# EAGLE design 405_led_jetracer (EAGLE 9.6.2)
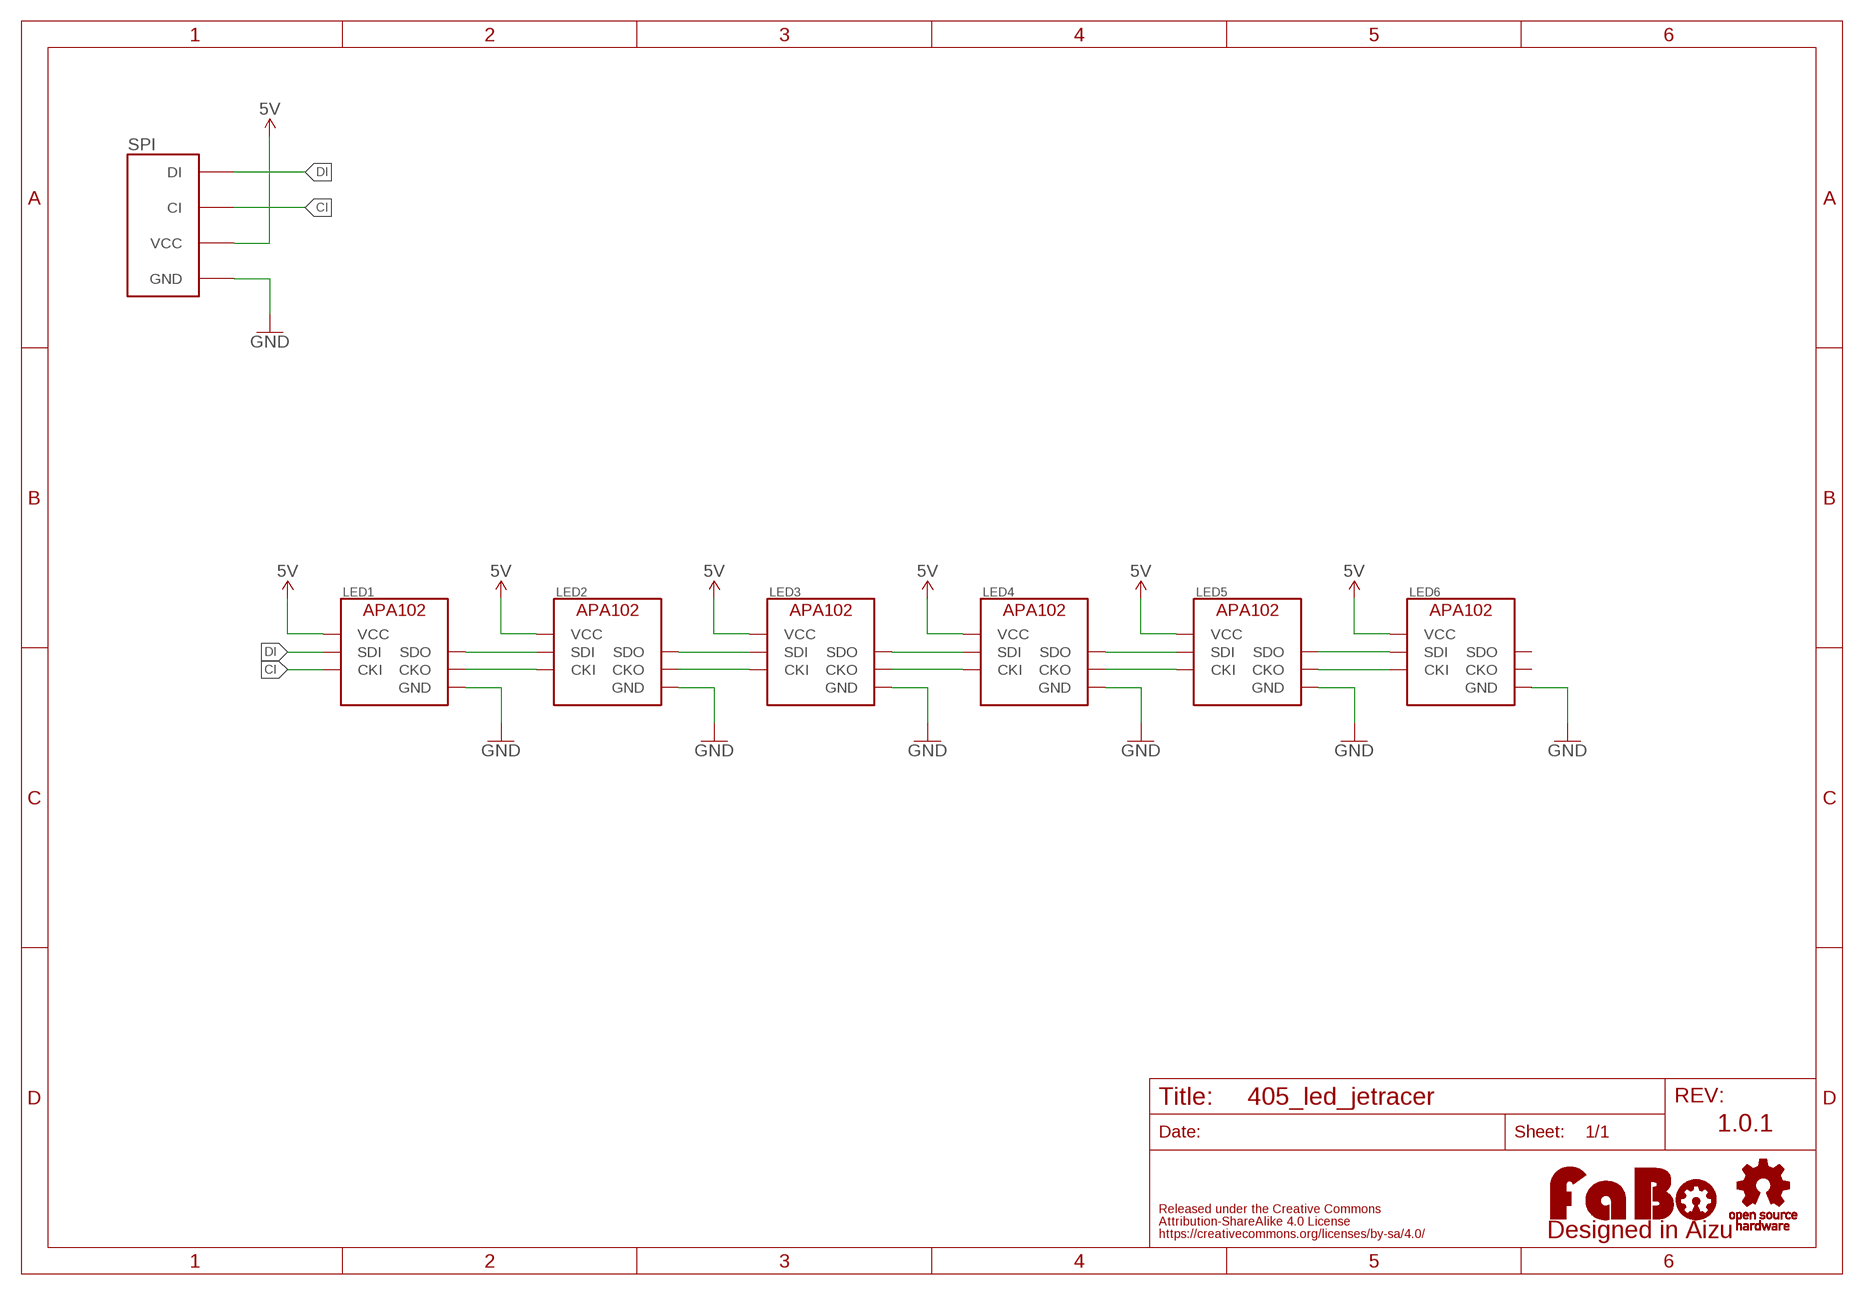
[diagram p0: schematic, sheet 1]

## Parts
LED1  APA102_IPIXEL  [APA102_2020]
LED2  APA102_IPIXEL  [APA102_2020]
LED3  APA102_IPIXEL  [APA102_2020]
LED4  APA102_IPIXEL  [APA102_2020]
LED5  APA102_IPIXEL  [APA102_2020]
LED6  APA102_IPIXEL  [APA102_2020]
LOGO1  LOGO_OSHW-S_BOTTOM  [LOGO_OSHW_S_BOTTOM]
LOGO2  LOGO_FABO-S  [LOGO_FABO_S]
SPI  FABO-SPI-LED-B04B  [SPI-B04B-PASK-1]

## Nets
5V: LED1.VCC LED2.VCC LED3.VCC LED4.VCC LED5.VCC LED6.VCC SPI.VCC
CI: LED1.CKI SPI.CI
CI1: LED1.CKO LED2.CKI
CI2: LED2.CKO LED3.CKI
CI3: LED3.CKO LED4.CKI
CI4: LED4.CKO LED5.CKI
CI5: LED5.CKO LED6.CKI
DI: LED1.SDI SPI.DI
DI1: LED1.SDO LED2.SDI
DI2: LED2.SDO LED3.SDI
DI3: LED3.SDO LED4.SDI
DI4: LED4.SDO LED5.SDI
DI5: LED5.SDO LED6.SDI
GND: LED1.GND LED2.GND LED3.GND LED4.GND LED5.GND LED6.GND SPI.GND
Unconnected: LED6.CKO LED6.SDO

## Notes on the sheet
- 1.0.1

## Library data of the parts
LED1-LED6 = FaBo-LED:APA102
LOGO1 = FaBo-Logo:LOGO_OSHW
LOGO2 = FaBo-Logo:LOGO_FABO
SPI = FaBo-Connetor:FABO-SPI-LED

## Board
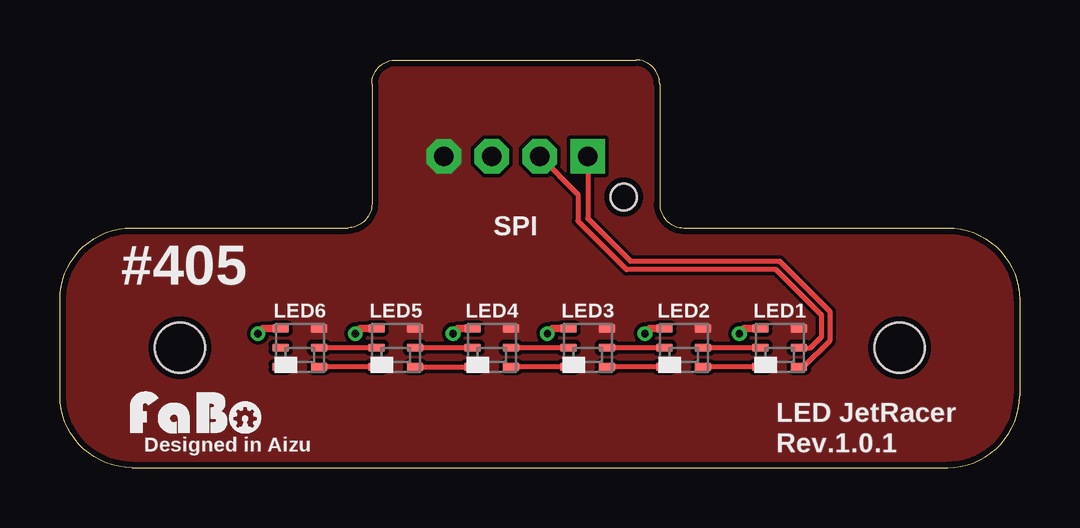
[diagram p1: board, top side]
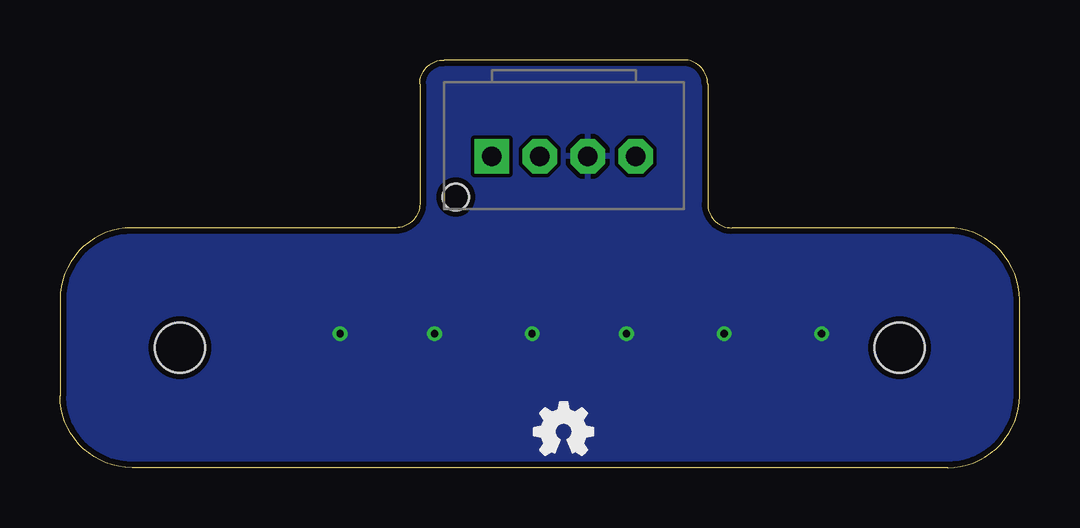
[diagram p2: board, bottom side, seen from below]

Size 40 x 17 mm. Coordinates in mm from the lower left corner, seen from the top.
Outline: 3,0 37,0 arc90 40,3 40,7 arc90 37,10 26,10 arc-90 25,11 25,16 arc90 24,17 14,17 arc90 13,16 13,11 arc-90 12,10 3,10 arc90 0,7 0,3 arc90 3,0
Copper layers (1*16): Top 0.035mm / dielectric 1.6mm / Bottom 0.035mm
Design rules "PCBway": minimum track width 6mil, minimum drill 12mil, track to track 6mil, track to pad 6mil, pad to pad 6mil, via to via 6mil, smd to smd 6mil, copper to edge 10mil, drill to drill 10mil, minimum pad ring 10mil, minimum via ring 6mil, stop-mask expansion 2mil, vias tented up to drill 100mil, thermal gap 8mil
Holes 2.1 mm at 5,5 35,5

### Footprints (pad centres in the part's own frame; a part is rotated, then mirrored left to right if it is on the bottom)
APA102_2020 = smd 0.7 x 0.35: CKI 0.8,0; CKO -0.8,0; GND 0.8,0.8; SDI 0.8,-0.8; SDO -0.8,-0.8; VCC -0.8,0.8
SPI-B04B-PASK-1 = drill 0.8 pad 1.422 octagon: CI 1,1.27; GND -3,1.27; VCC -1,1.27 | drill 0.8 pad 1.422 square: DI 3,1.27 | hole 1.1: 4.5,2.97

### Placement (x,y rotation side)
LED1  30,5 0 top
LED2  26,5 0 top
LED3  22,5 0 top
LED4  18,5 0 top
LED5  14,5 0 top
LED6  10,5 0 top
LOGO1  19,1.5 0 top
LOGO2  5.71,1.27 0 top
SPI  19,14.25 180 bottom

### Tracks (layer width: path | path; a pad name or v marks a point on that pad's centre or on a via)
5V  (via drill 0.3)
  Top 0.305: LED1.VCC 28.53,5.8 v28.32,5.59 | LED2.VCC 24.6,5.8 v24.38,5.59 | LED3.VCC 20.53,5.8 v20.32,5.59 | LED4.VCC 16.59,5.8 v16.38,5.59 | LED5.VCC 12.53,5.8 v12.32,5.59 | LED6.VCC 8.47,5.8 v8.26,5.59
  pour Bottom (isolate 0.152, rank 3): 0,0 40,0 40,17 0,17
CI
  Top 0.203: LED1.CKI 31.29,5 31.75,5.46 31.75,6.35 29.84,8.26 23.62,8.26 21.59,10.29 21.59,11.39 SPI.CI
CI1
  Top 0.203: LED1.CKO LED2.CKI
CI2
  Top 0.203: LED2.CKO LED3.CKI
CI3
  Top 0.203: LED3.CKO LED4.CKI
CI4
  Top 0.203: LED4.CKO LED5.CKI
CI5
  Top 0.203: LED5.CKO LED6.CKI
DI
  Top 0.203: SPI.DI 22,10.38 23.77,8.61 29.99,8.61 32.11,6.5 32.11,5.31 31,4.2 LED1.SDI
DI1
  Top 0.203: LED1.SDO LED2.SDI
DI2
  Top 0.203: LED2.SDO LED3.SDI
DI3
  Top 0.203: LED3.SDO LED4.SDI
DI4
  Top 0.203: LED5.SDI LED4.SDO
DI5
  Top 0.203: LED5.SDO LED6.SDI
GND
  pour Top (isolate 0.152, rank 3, no thermals): 0,0 40,0 40,17 0,17

### Text on the board
tPlace: #405 | LED JetRacer | Designed in Aizu | Rev.1.0.1